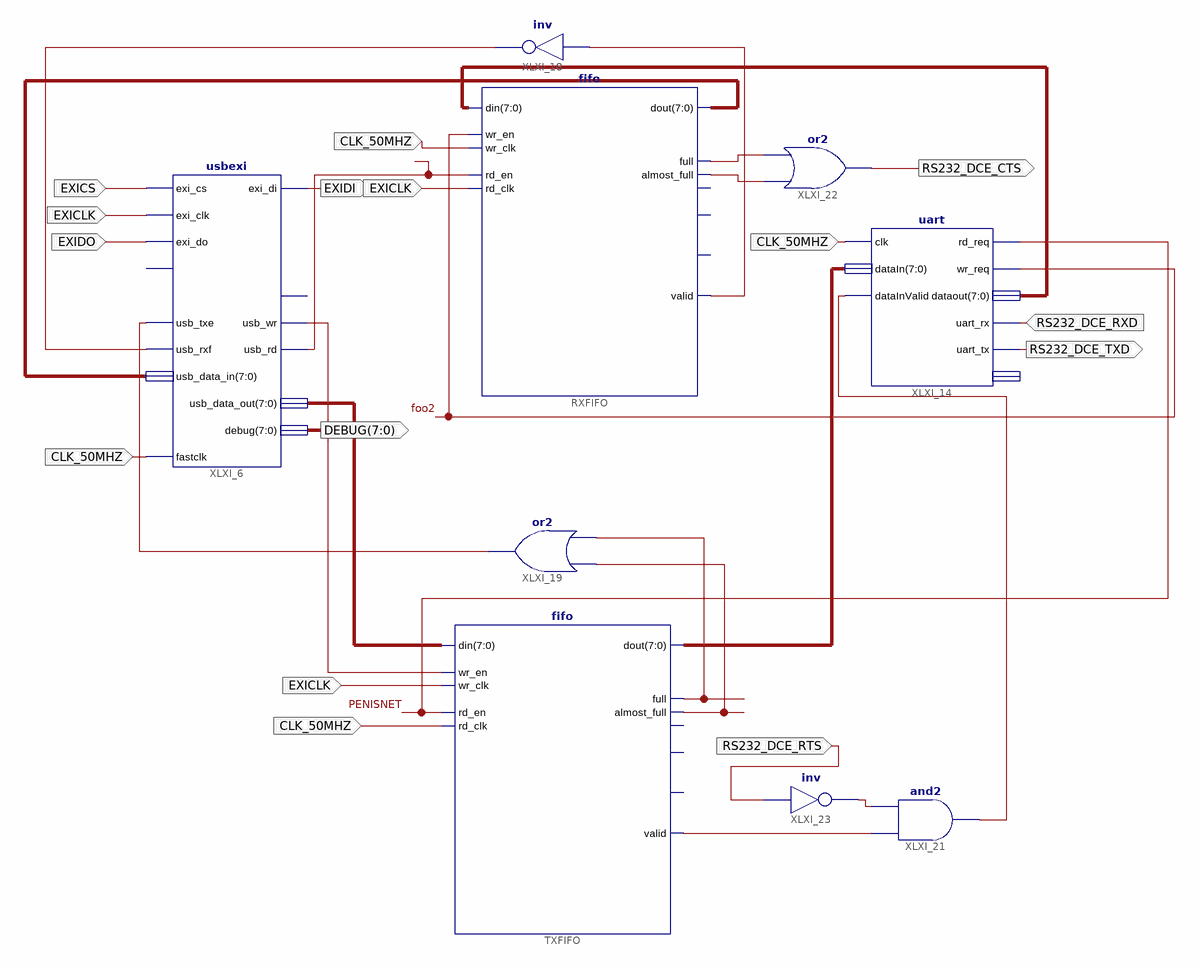
[diagram p0: schematic sheet 1]
// Xilinx ISE schematic top.sch (spartan3e) as structural Verilog: 9 symbols, 10 ports
module top (
  input  EXIDO,
  input  EXICS,
  input  EXICLK,
  input  CLK_50MHZ,
  input  RS232_DCE_RXD,
  input  RS232_DCE_RTS,
  output RS232_DCE_TXD,
  output EXIDI,
  output RS232_DCE_CTS,
  output [7:0] DEBUG
);

  wire BLAH, BLAH2, foo, foo2, PENISNET, XLXN_91, XLXN_161, XLXN_163, XLXN_186, XLXN_190, XLXN_192, XLXN_193,
       XLXN_213, XLXN_214;
  wire [7:0] XLXN_63, XLXN_82, XLXN_141, XLXN_185;

  usbexi XLXI_6 (
    .usb_txe(XLXN_163), .usb_rxf(XLXN_161), .exi_cs(EXICS), .exi_clk(EXICLK), .exi_do(EXIDO),
    .usb_data_in(XLXN_82), .usb_rd(foo), .usb_wr(XLXN_91), .exi_di(EXIDI), .usb_data_out(XLXN_185),
    .debug(DEBUG), .fastclk(CLK_50MHZ));  // open: exi_int, led
  fifo TXFIFO (
    .din(XLXN_185), .wr_en(XLXN_91), .wr_clk(EXICLK), .rd_en(PENISNET), .rd_clk(CLK_50MHZ), .dout(XLXN_141),
    .full(BLAH), .almost_full(BLAH2), .valid(XLXN_214));  // open: prog_full, overflow, empty
  fifo RXFIFO (
    .din(XLXN_63), .wr_en(foo2), .wr_clk(CLK_50MHZ), .rd_en(foo), .rd_clk(EXICLK), .dout(XLXN_82),
    .full(XLXN_192), .almost_full(XLXN_193), .valid(XLXN_186));  // open: prog_full, overflow, empty
  not XLXI_18 (XLXN_161, XLXN_186);
  or XLXI_19 (XLXN_163, BLAH, BLAH2);
  uart XLXI_14 (
    .clk(CLK_50MHZ), .dataInValid(XLXN_190), .uart_rx(RS232_DCE_RXD), .dataIn(XLXN_141), .rd_req(PENISNET),
    .wr_req(foo2), .uart_tx(RS232_DCE_TXD), .dataout(XLXN_63));  // open: debug
  and XLXI_21 (XLXN_190, XLXN_214, XLXN_213);
  or XLXI_22 (RS232_DCE_CTS, XLXN_193, XLXN_192);
  not XLXI_23 (XLXN_213, RS232_DCE_RTS);
endmodule
